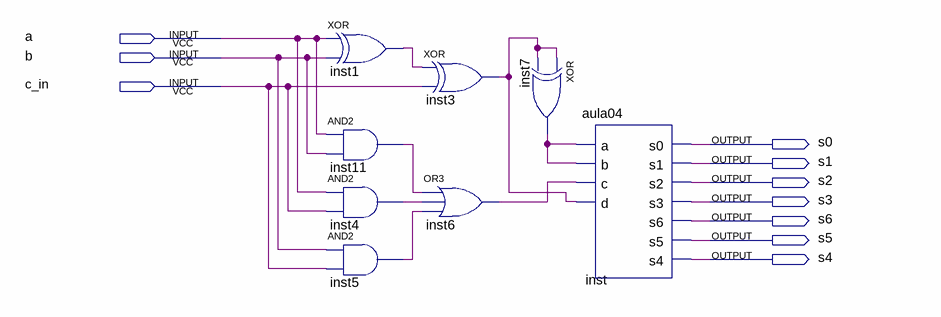
[diagram p0: schematic sheet]
// Quartus schematic aula05.bdf as structural Verilog: 8 symbols, 10 pins
module aula05 (
  input  a,
  input  b,
  input  c_in,
  output s0,
  output s1,
  output s2,
  output s3,
  output s6,
  output s5,
  output s4
);

  wire inst1_out, inst3_out, inst4_out, inst5_out, inst6_out, inst7_out, inst11_out;

  xor inst1 (inst1_out, a, b);
  and inst11 (inst11_out, a, b);
  and inst4 (inst4_out, a, c_in);
  and inst5 (inst5_out, b, c_in);
  xor inst3 (inst3_out, inst1_out, c_in);
  or inst6 (inst6_out, inst11_out, inst4_out, inst5_out);
  xor inst7 (inst7_out, inst3_out, inst3_out);
  aula04 inst (
    .a(inst7_out), .b(inst7_out), .c(inst6_out), .d(inst3_out), .s0(s0), .s1(s1), .s2(s2), .s3(s3), .s6(s6),
    .s5(s5), .s4(s4));
endmodule
